# EAGLE schematic base-base (EAGLE 7.2.0)

## Sheet 1 of 2
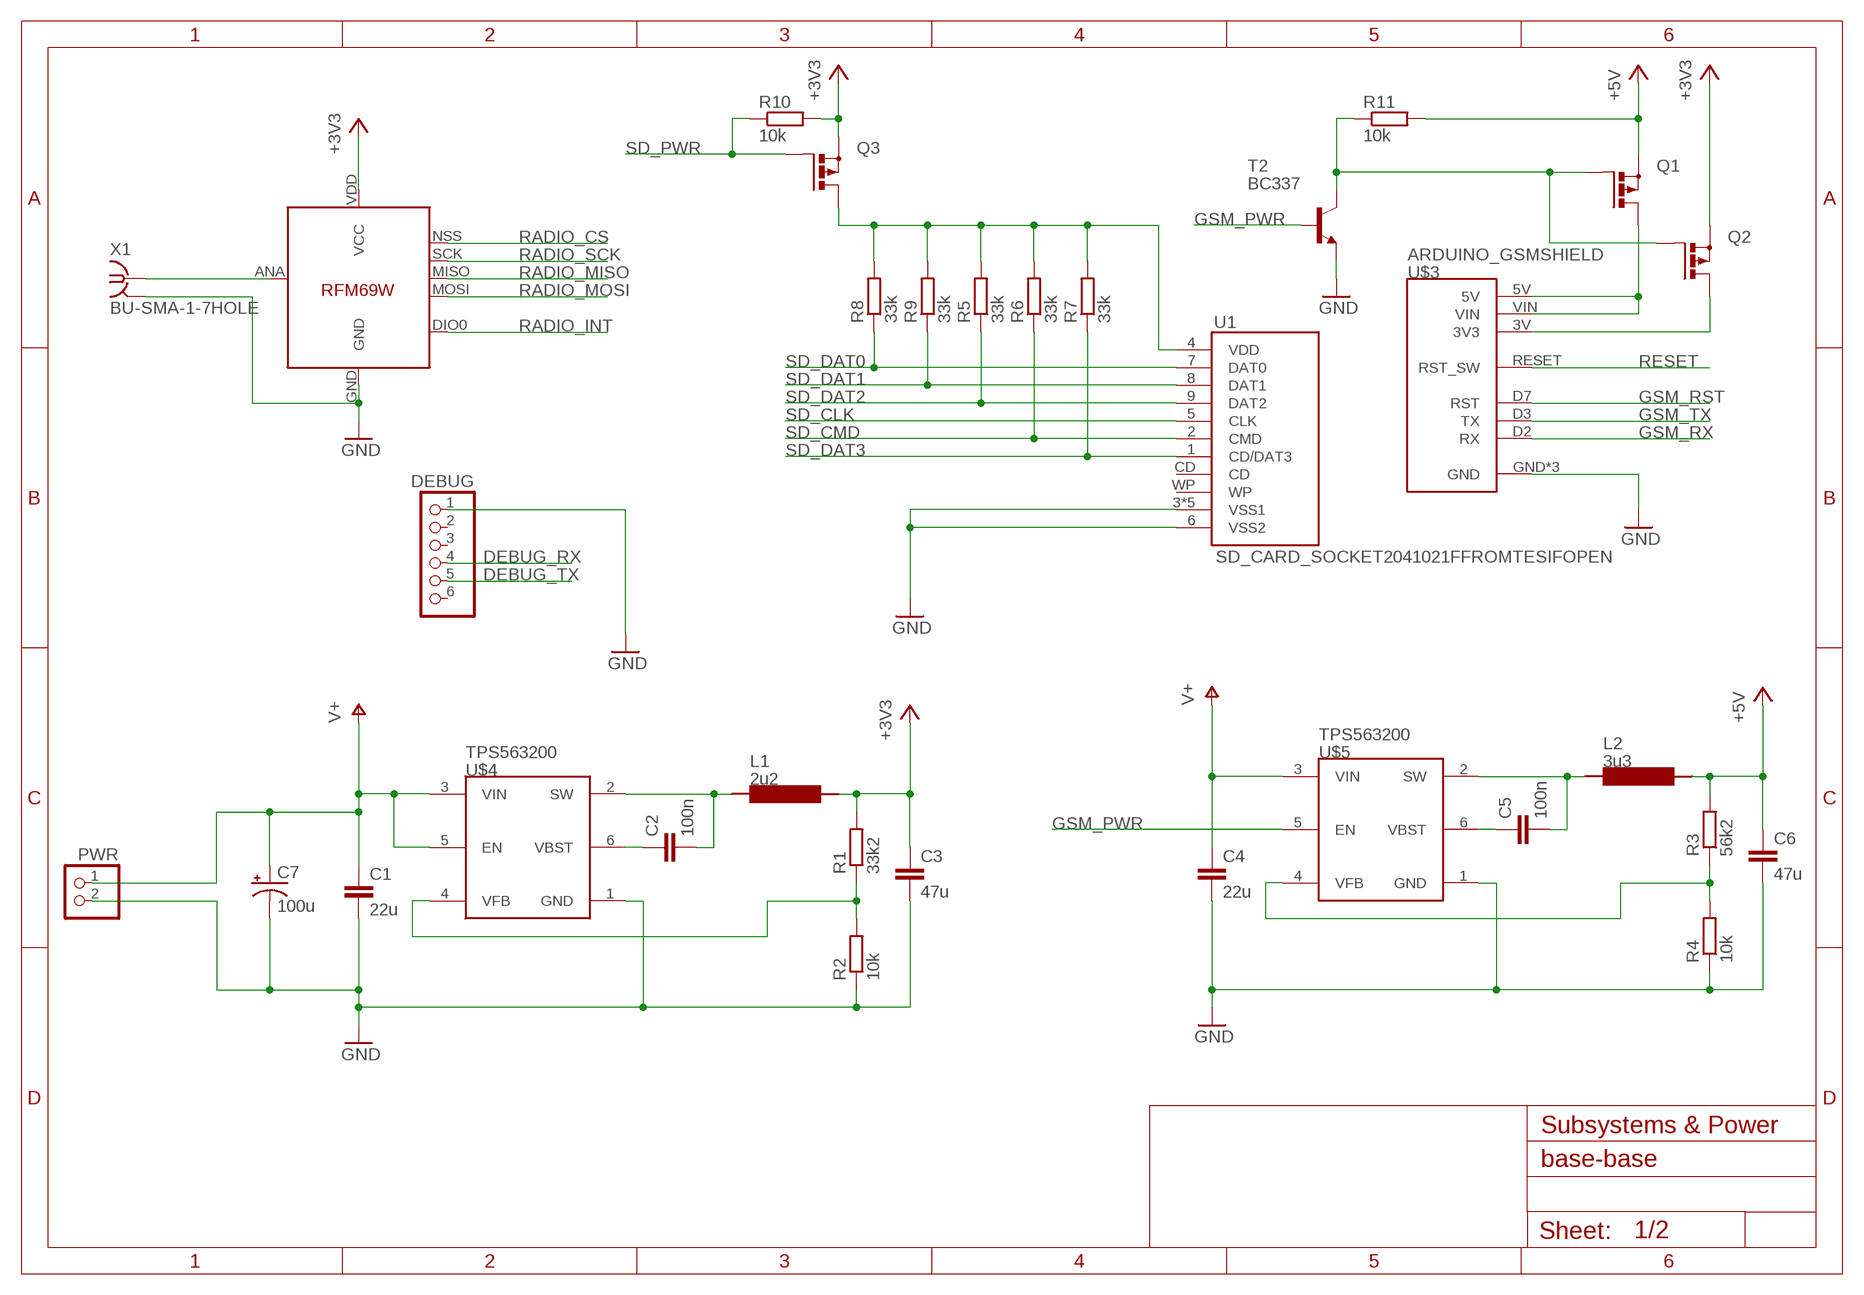
[diagram p0: schematic, sheet 1]

### Parts
C1  22u  CAP1206  [1206]
C2  100n  CAPPTH  [CAP-PTH-SMALL]
C3  47u  CAP1206  [1206]
C4  22u  CAP1206  [1206]
C5  100n  CAPPTH  [CAP-PTH-SMALL]
C6  47u  CAP1206  [1206]
C7  100u  CAP_POLPTH2  [CPOL-RADIAL-10UF-25V]
DEBUG  PINHD-1X6  [1X06]
L1  2u2  SRR7032  [SRR7032]
L2  3u3  SRR7032  [SRR7032]
PWR  PINHD-1X2  [1X02]
Q1  PMOSFET_PTO220BH  [TO220BH]
Q2  PMOSFET_PTO220BH  [TO220BH]
Q3  PMOSFET_PTO220BH  [TO220BH]
R1  33k2  R-EU_0204/7  [0204/7]
R2  10k  R-EU_0204/7  [0204/7]
R3  56k2  R-EU_0204/7  [0204/7]
R4  10k  R-EU_0204/7  [0204/7]
R5  33k  R-EU_0204/7  [0204/7]
R6  33k  R-EU_0204/7  [0204/7]
R7  33k  R-EU_0204/7  [0204/7]
R8  33k  R-EU_0204/7  [0204/7]
R9  33k  R-EU_0204/7  [0204/7]
R10  10k  R-EU_0204/7  [0204/7]
R11  10k  R-EU_0204/7  [0204/7]
T2  BC337  [TO92]
U1  SD_CARD_SOCKET2041021FFROMTESIFOPEN  [SDCARD_2041021-3]
U$2  RFM69  [RFM69W-MINPADS]
U$3  ARDUINO_GSMSHIELD  [ARDUINO-NOHOLE]
U$4  TPS563200  [DDC0006A]
U$5  TPS563200  [DDC0006A]
X1  BU-SMA-1-7HOLE  [SMA_1-7HOLES]

### Nets
+3V3: C3.1 L1.2 Q2.S Q3.S R1.2 R10.2 U$2.VDD(VCC) ; also sheet 2
+5V: C6.1 L2.2 Q1.S R3.2 R11.2 ; also sheet 2
DEBUG_RX: DEBUG.4 ; also sheet 2
DEBUG_TX: DEBUG.5 ; also sheet 2
GND: C1.2 C3.2 C4.2 C6.2 C7.2(-) DEBUG.1 PWR.2 R2.1 R4.1 T2.1(E) U1.3(VSS1) U1.6(VSS2) U1.SH1(VSS1) U1.SH2(VSS1) U1.SH3(VSS1) U1.SH4(VSS1) U$2.GND U$3.GND U$3.GND1(GND) U$3.GND2(GND) U$4.1(GND) U$5.1(GND) X1.2 X1.3 X1.4 X1.5 ; also sheet 2
GSM_PWR: T2.2(B) U$5.5(EN) ; also sheet 2
GSM_RST: U$3.D7(RST) ; also sheet 2
GSM_RX: U$3.D2(RX) ; also sheet 2
GSM_TRANSISTORLINE: Q1.G Q2.G R11.1 T2.3(C)
GSM_TX: U$3.D3(TX) ; also sheet 2
N$1: Q1.D U$3.5V U$3.VIN
N$2: Q2.D U$3.3V(3V3)
RADIO_ANT: U$2.ANA(ANT) X1.1
RADIO_CS: U$2.NSS(SEL) ; also sheet 2
RADIO_INT: U$2.DIO0 ; also sheet 2
RADIO_MISO: U$2.MISO ; also sheet 2
RADIO_MOSI: U$2.MOSI ; also sheet 2
RADIO_SCK: U$2.SCK ; also sheet 2
RESET: U$3.RESET(RST_SW) ; also sheet 2
SD_CLK: U1.5(CLK) ; also sheet 2
SD_CMD: R6.1 U1.2(CMD) ; also sheet 2
SD_DAT0: R8.1 U1.7(DAT0) ; also sheet 2
SD_DAT1: R9.1 U1.8(DAT1) ; also sheet 2
SD_DAT2: R5.1 U1.9(DAT2) ; also sheet 2
SD_DAT3: R7.1 U1.1(CD/DAT3) ; also sheet 2
SD_PWR: Q3.G R10.1 ; also sheet 2
SD_VCC: Q3.D R5.2 R6.2 R7.2 R8.2 R9.2 U1.4(VDD)
V+: C1.1 C4.1 C7.1(+) PWR.1 U$4.3(VIN) U$4.5(EN) U$5.3(VIN)
VREG_3_SW: C2.2 L1.1 U$4.2(SW)
VREG_3_VBST: C2.1 U$4.6(VBST)
VREG_3_VFB: R1.1 R2.2 U$4.4(VFB)
VREG_5_SW: C5.2 L2.1 U$5.2(SW)
VREG_5_VBST: C5.1 U$5.6(VBST)
VREG_5_VFB: R3.1 R4.2 U$5.4(VFB)
Unconnected: DEBUG.2 DEBUG.3 DEBUG.6 U1.CD U1.WP

### Notes on the sheet
- Subsystems & Power

## Sheet 2 of 2
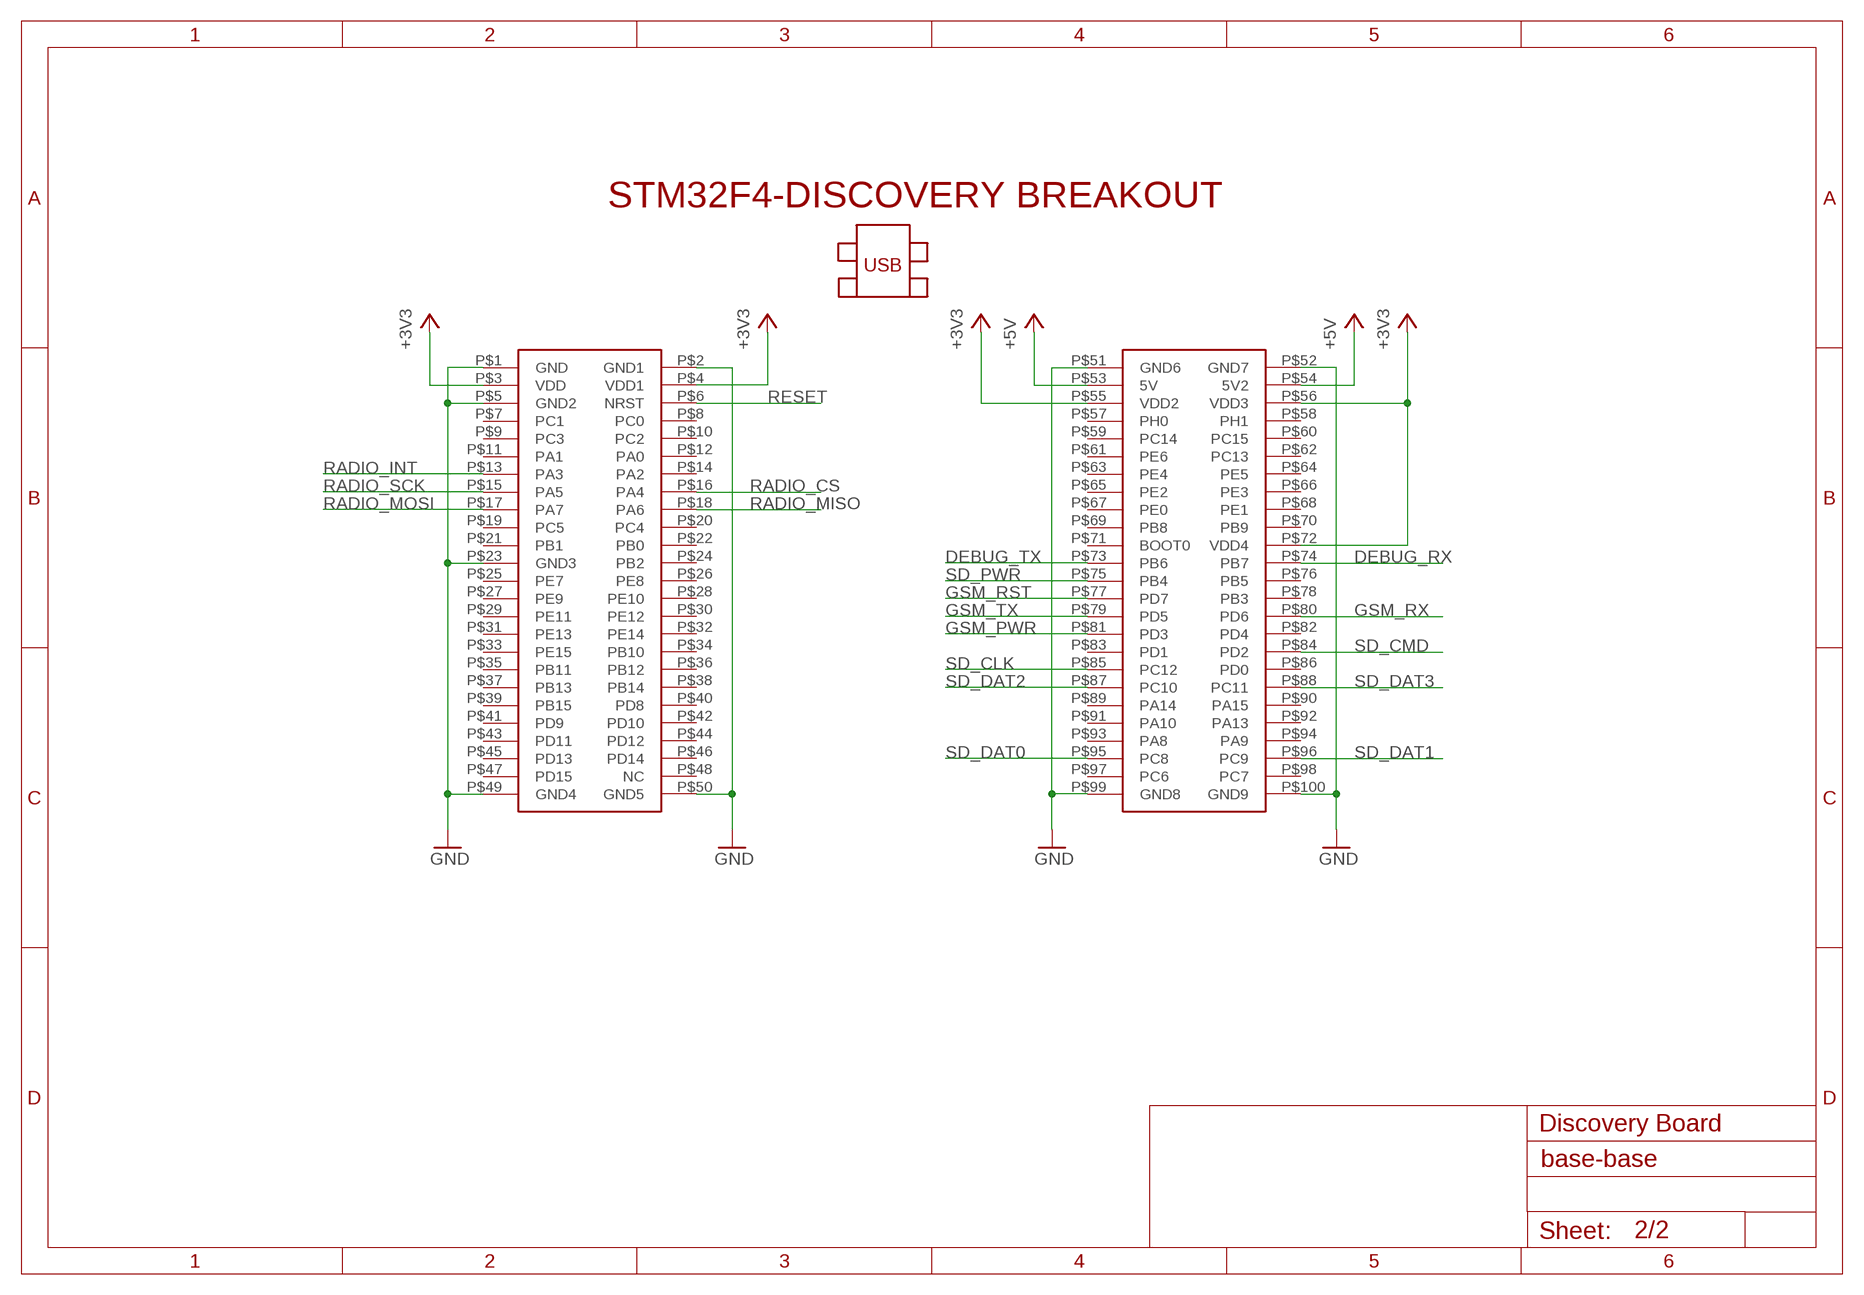
[diagram p1: schematic, sheet 2]

### Parts
U$1  STM32F4-DISCOVERY  [STM32F4-DISCOVERY]

### Nets
+3V3: U$1.P$3(VDD) U$1.P$4(VDD1) U$1.P$55(VDD2) U$1.P$56(VDD3) U$1.P$72(VDD4) ; also sheet 1
+5V: U$1.P$53(5V) U$1.P$54(5V2) ; also sheet 1
DEBUG_RX: U$1.P$74(PB7) ; also sheet 1
DEBUG_TX: U$1.P$73(PB6) ; also sheet 1
GND: U$1.P$1(GND) U$1.P$2(GND1) U$1.P$5(GND2) U$1.P$23(GND3) U$1.P$49(GND4) U$1.P$50(GND5) U$1.P$51(GND6) U$1.P$52(GND7) U$1.P$99(GND8) U$1.P$100(GND9) ; also sheet 1
GSM_PWR: U$1.P$81(PD3) ; also sheet 1
GSM_RST: U$1.P$77(PD7) ; also sheet 1
GSM_RX: U$1.P$80(PD6) ; also sheet 1
GSM_TX: U$1.P$79(PD5) ; also sheet 1
RADIO_CS: U$1.P$16(PA4) ; also sheet 1
RADIO_INT: U$1.P$13(PA3) ; also sheet 1
RADIO_MISO: U$1.P$18(PA6) ; also sheet 1
RADIO_MOSI: U$1.P$17(PA7) ; also sheet 1
RADIO_SCK: U$1.P$15(PA5) ; also sheet 1
RESET: U$1.P$6(NRST) ; also sheet 1
SD_CLK: U$1.P$85(PC12) ; also sheet 1
SD_CMD: U$1.P$84(PD2) ; also sheet 1
SD_DAT0: U$1.P$95(PC8) ; also sheet 1
SD_DAT1: U$1.P$96(PC9) ; also sheet 1
SD_DAT2: U$1.P$87(PC10) ; also sheet 1
SD_DAT3: U$1.P$88(PC11) ; also sheet 1
SD_PWR: U$1.P$75(PB4) ; also sheet 1
Unconnected: U$1.P$7(PC1) U$1.P$8(PC0) U$1.P$9(PC3) U$1.P$10(PC2) U$1.P$11(PA1) U$1.P$12(PA0) U$1.P$14(PA2) U$1.P$19(PC5) U$1.P$20(PC4) U$1.P$21(PB1) U$1.P$22(PB0) U$1.P$24(PB2) U$1.P$25(PE7) U$1.P$26(PE8) U$1.P$27(PE9) U$1.P$28(PE10) U$1.P$29(PE11) U$1.P$30(PE12) U$1.P$31(PE13) U$1.P$32(PE14) U$1.P$33(PE15) U$1.P$34(PB10) U$1.P$35(PB11) U$1.P$36(PB12) U$1.P$37(PB13) U$1.P$38(PB14) U$1.P$39(PB15) U$1.P$40(PD8) U$1.P$41(PD9) U$1.P$42(PD10) U$1.P$43(PD11) U$1.P$44(PD12) U$1.P$45(PD13) U$1.P$46(PD14) U$1.P$47(PD15) U$1.P$48(NC) U$1.P$57(PH0) U$1.P$58(PH1) U$1.P$59(PC14) U$1.P$60(PC15) U$1.P$61(PE6) U$1.P$62(PC13) U$1.P$63(PE4) U$1.P$64(PE5) U$1.P$65(PE2) U$1.P$66(PE3) U$1.P$67(PE0) U$1.P$68(PE1) U$1.P$69(PB8) U$1.P$70(PB9) U$1.P$71(BOOT0) U$1.P$76(PB5) U$1.P$78(PB3) U$1.P$82(PD4) U$1.P$83(PD1) U$1.P$86(PD0) U$1.P$89(PA14) U$1.P$90(PA15) U$1.P$91(PA10) U$1.P$92(PA13) U$1.P$93(PA8) U$1.P$94(PA9) U$1.P$97(PC6) U$1.P$98(PC7)

### Notes on the sheet
- Discovery Board

## Library data of the parts
C1-C6 = SparkFun-Capacitors:CAP: Capacitor Standard 0603 ceramic capacitor, and 0.1" leaded capacitor.
C7 = SparkFun-Passives:CAP_POL: Capacitor Polarized These are standard SMD and PTH capacitors. Normally 10uF, 47uF, and 100uF in electrolytic and tantalum varieties. Always verify the external diameter of the through hole cap, it varies with capacity, voltage, and manufacturer. The EIA devices should be standard.
DEBUG = pinhead:PINHD-1X6: PIN HEADER
L1 L2 = FullyCustom:SRR7032
PWR = pinhead:PINHD-1X2: PIN HEADER
Q1-Q3 = transistor-power:PMOSFET_P: Power MOSFET P-Channel
R1-R11 = resistor:R-EU_: RESISTOR, European symbol
T2 = transistor:BC337: NPN TRANSISTOR
U1 = FullyCustom:SD_CARD_SOCKET: SD Memory Card Connector, push-push normal type, CD enable, WP enable
U$1 = STM32F4-DISCOVERY:STM32F4-DISCOVERY
U$2 = Moteino:RFM69
U$3 = FullyCustom:ARDUINO_GSMSHIELD
U$4 U$5 = FullyCustom:TPS563200
X1 = FullyCustom:BU-SMA-1-7HOLE: FEMALE SMA CONNECTOR Radiall distributor RS 112-3794; OC_FARNELL: unknown; OC_NEWARK: unknown